# EAGLE design TalkingClock (EAGLE 8.7.0)
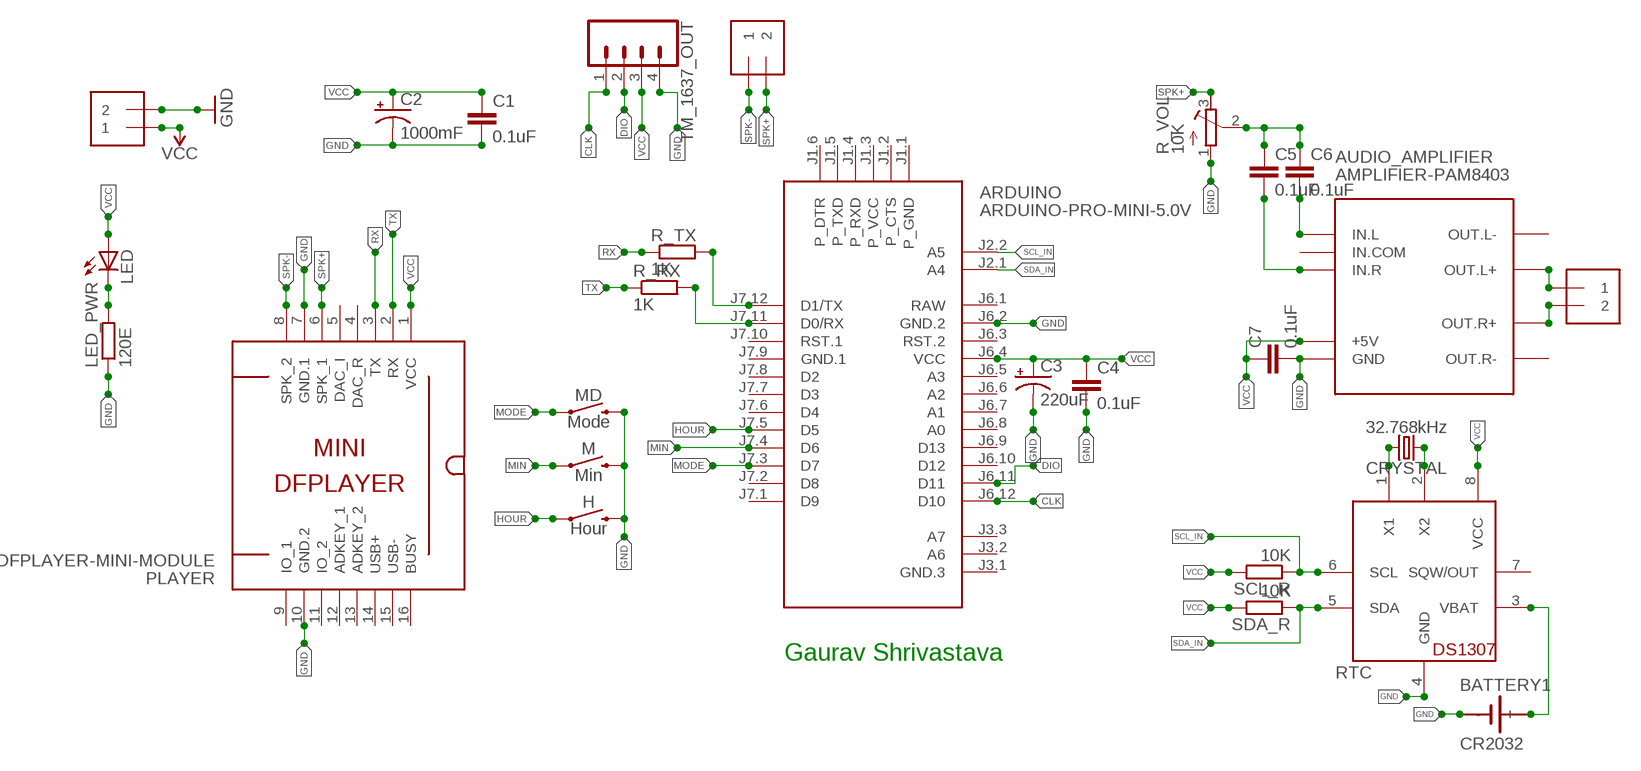
[diagram p0: schematic, sheet 1]

## Parts
ARDUINO  ARDUINO-PRO-MINI-5.0V  [ARDUINO-PRO-MINI]
AUDIO_AMPLIFIER  AMPLIFIER-PAM8403  [AMPLIFIER-PAM8403]
BATTERY1  CR2032  SN2032  [SN2032]
C1  0.1uF  0.1UF-KIT-EZ-50V-20%  [CAP-PTH-SMALL-KIT]
C2  1000mF  1000UF-RADIAL-5MM-25V-20%  [CPOL-RADIAL-5MM-10MM]
C3  220uF  100UF-POLAR-RADIAL-2.5MM-25V-20%  [CPOL-RADIAL-2.5MM-6.5MM]
C4  0.1uF  0.1UF-KIT-EZ-50V-20%  [CAP-PTH-SMALL-KIT]
C5  0.1uF  0.1UF-KIT-EZ-50V-20%  [CAP-PTH-SMALL-KIT]
C6  0.1uF  0.1UF-KIT-EZ-50V-20%  [CAP-PTH-SMALL-KIT]
C7  0.1uF  0.1UF-KIT-EZ-50V-20%  [CAP-PTH-SMALL-KIT]
CRYSTAL  32.768kHz  CRYSTAL-32.768KHZPTH-2X6  [CRYSTAL-PTH-2X6-CYL]
H  Hour  MOMENTARY-SWITCH-SPST-PTH-6.0MM  [TACTILE_SWITCH_PTH_6.0MM]
LED  LED5MM  [LED5MM]
LED_PWR  120E  R-EU_0204/7  [0204/7]
M  Min  MOMENTARY-SWITCH-SPST-PTH-6.0MM  [TACTILE_SWITCH_PTH_6.0MM]
MD  Mode  MOMENTARY-SWITCH-SPST-PTH-6.0MM  [TACTILE_SWITCH_PTH_6.0MM]
PLAYER  DFPLAYER-MINI-MODULE  [DFPLAYER-MINI-MODULE]
POWER-5-V  SPEAKER  1X2-3.5MM  [1X2-3.5MM]
PRE_SPK_OUT  SPEAKER  1X2-3.5MM  [1X2-3.5MM]
R_RX  1K  R-EU_0204/7  [0204/7]
R_TX  1K  R-EU_0204/7  [0204/7]
R_VOL  10K  R-TRIMM4G/J  [RTRIM4G/J]
RTC  DS1307  [DIL08]
SCL_R  10K  R-EU_0204/7  [0204/7]
SDA_R  10K  R-EU_0204/7  [0204/7]
SPEAKER  SPEAKER  1X2-3.5MM  [1X2-3.5MM]
TM_1637_OUT  CONN_04  [1X04]

## Nets
CLK: ARDUINO.J6.12(D10) TM_1637_OUT.1
DIO: ARDUINO.J6.11(D11) TM_1637_OUT.2
GND: ARDUINO.J6.2(GND.2) AUDIO_AMPLIFIER.GND BATTERY1.- C1.2 C2.- C3.2(-) C4.2 C7.2 H.3 LED_PWR.1 M.3 MD.3 PLAYER.7(GND.1) PLAYER.10(GND.2) POWER-5-V.2 R_VOL.1(A) RTC.4(GND) TM_1637_OUT.4
HOUR: ARDUINO.J7.5(D5) H.1
MIN: ARDUINO.J7.4(D6) M.1
MODE: ARDUINO.J7.3(D7) MD.1
N$1: ARDUINO.J7.12(D1/TX) R_TX.2
N$2: ARDUINO.J7.11(D0/RX) R_RX.2
N$3: LED.K(C) LED_PWR.2
N$4: CRYSTAL.2 RTC.1(X1)
N$5: CRYSTAL.1 RTC.2(X2)
N$6: AUDIO_AMPLIFIER.IN.L C6.2
N$7: AUDIO_AMPLIFIER.IN.R C5.2
N$8: AUDIO_AMPLIFIER.OUT.L+ SPEAKER.1
N$9: AUDIO_AMPLIFIER.OUT.R+ SPEAKER.2
N$13: BATTERY1.+ RTC.3(VBAT)
RX: PLAYER.3(TX) R_TX.1
SCL_IN: ARDUINO.J2.2(A5) RTC.6(SCL) SCL_R.1
SDA_IN: ARDUINO.J2.1(A4) RTC.5(SDA) SDA_R.1
SPK+: C5.1 C6.1 PLAYER.6(SPK_1) PRE_SPK_OUT.2 R_VOL.2(S) R_VOL.3(E)
SPK-: PLAYER.8(SPK_2) PRE_SPK_OUT.1
TX: PLAYER.2(RX) R_RX.1
VCC: ARDUINO.J6.4(VCC) AUDIO_AMPLIFIER.+5V C1.1 C2.+ C3.1(+) C4.1 C7.1 LED.A PLAYER.1(VCC) POWER-5-V.1 RTC.8(VCC) SCL_R.2 SDA_R.2 TM_1637_OUT.3
Unconnected: ARDUINO.J1.1(P_GND) ARDUINO.J1.2(P_CTS) ARDUINO.J1.3(P_VCC) ARDUINO.J1.4(P_RXD) ARDUINO.J1.5(P_TXD) ARDUINO.J1.6(P_DTR) ARDUINO.J3.1(GND.3) ARDUINO.J3.2(A6) ARDUINO.J3.3(A7) ARDUINO.J6.3(RST.2) ARDUINO.J6.5(A3) ARDUINO.J6.6(A2) ARDUINO.J6.7(A1) ARDUINO.J6.8(A0) ARDUINO.J6.9(D13) ARDUINO.J6.10(D12) ARDUINO.J7.1(D9) ARDUINO.J7.2(D8) ARDUINO.J7.6(D4) ARDUINO.J7.7(D3) ARDUINO.J7.8(D2) ARDUINO.J7.10(RST.1) AUDIO_AMPLIFIER.IN.COM AUDIO_AMPLIFIER.OUT.L- AUDIO_AMPLIFIER.OUT.R- PLAYER.4(DAC_R) PLAYER.5(DAC_I) PLAYER.9(IO_1) PLAYER.11(IO_2) PLAYER.12(ADKEY_1) PLAYER.13(ADKEY_2) PLAYER.14(USB+) PLAYER.15(USB-) PLAYER.16(BUSY) RTC.7(SQW/OUT)

## Notes on the sheet
- Gaurav Shrivastava

## Power pins joined to a net without a drawn wire
GND.1: ARDUINO.J7.9(GND.1)
RAW: ARDUINO.J6.1(RAW)

## Library data of the parts
ARDUINO = diy-modules:ARDUINO-PRO-MINI-*: Arduino Pro Mini and compatible devices More details available here: https://www.arduino.cc/en/Main/ArduinoBoardProMini Click here to find device on ebay.com <http://www.ebay.com/sch/arduino+pro+mini>
AUDIO_AMPLIFIER = diy-modules:AMPLIFIER-PAM8403: Stereo Class-D 3W Audio Amplifier based on PAM8403 chip More details available here: http://artofcircuits.com/product/pam8403-5v-two-channel-stereo-mini-class-d-3w3w-audio-amplifier Click here to find device on ebay.com <http://www.ebay.com/sch/pam8403+mini+class+d>
BATTERY1 = sn2032:SN2032: LI BATTERY
C1 C4-C7 = SparkFun-Capacitors:0.1UF: 0.1µF ceramic capacitors A capacitor is a passive two-terminal electrical component used to store electrical energy temporarily in an electric field.; PROD_ID: CAP-08370
C2 = SparkFun-Capacitors:1000UF: 1,000µF/1mF ceramic capacitors A capacitor is a passive two-terminal electrical component used to store electrical energy temporarily in an electric field. CAP-08070; PROD_ID: CAP-09538; VALUE: 1mF
C3 = SparkFun-Capacitors:100UF-POLAR: 100µF polarized capacitors A capacitor is a passive two-terminal electrical component used to store electrical energy temporarily in an electric field.; PROD_ID: CAP-08439; VALUE: 100uF
CRYSTAL = SparkFun-Clocks:CRYSTAL-32.768KHZ: 32.768kHz Crystal Frequency: 32.768kHz Frequency Stability: ±20ppm Load Capacitance: 12.5pF (PTH-2X6 & SMD-3.2X1.5), 6pF (SMD-2X6) SparkFun Products: SparkFun BigTime Watch Kit <https://www.sparkfun.com/products/11734> SparkFun nRF52832 Breakout <https://www.sparkfun.com/products/13990> SparkFun Real Time Clock Module <https://www.sparkfun.com/products/12708>; PROD_ID: XTAL-10112
H M MD = SparkFun-Switches:MOMENTARY-SWITCH-SPST: Momentary Switch (Pushbutton) - SPST Normally-open (NO) SPST momentary switches (buttons, pushbuttons). Variants PTH-12MM - 12mm square, through-hole Momentary Pushbutton Switch - 12mm Square <https://www.sparkfun.com/products/9190> (COM-09190) PTH-6.0MM, PTH-6.0MM-KIT - 6.0mm square, through-hole Mini Pushbutton Switch <https://www.sparkfun.com/products/97> (COM-00097) KIT package intended for soldering kit's - only one side of pads' copper is exposed. PTH-RIGHT-ANGLE-KIT - Right-angle, through-hole Right Angle Tactile Button <https://www.sparkfun.com/products/10791> - Used on SparkFun BigTime Watch Kit <https://www.sparkfun.com/products/11734> SMD-12MM - 12mm square, surface-mount Tactile Button - SMD (12mm) <https://www.sparkfun.com/products/12993> (COM-12993) Used on SparkFun PicoBoard <https://www.sparkfun.com/products/11888> SMD-4.5MM - 4.5mm Square Trackball Switch Used on SparkFun Blackberry Trackballer Breakout <https://www.sparkfun.com/products/13169> SMD-4.6MMX2.8MM - 4.60mm x 2.80mm, surface mount Used on SparkFun SAMD21 Mini Breakout <https://www.sparkfun.com/products/13664> SMD-5.2MM, SMD-5.2-REDUNDANT - 5.2mm square, surface-mount Mini Pushbutton Switch - SMD <https://www.sparkfun.com/products/8720> (COM-08720) Used on Arduino Pro Mini <https://www.sparkfun.com/products/11114> REDUNDANT package connects both switch circuits together SMD-6.0X3.5MM - 6.0 x 3.5mm, surface mount Momentary Reset Switch SMD <https://www.sparkfun.com/products/8229> (COM-08229) SMD-6.2MM-TALL - 6.2mm square, surface mount Tactile Button - SMD (6mm) <https://www.sparkfun.com/products/12992> Used on SparkFun Digital Sandbox <https://www.sparkfun.com/products/12651> SMD-RIGHT-ANGLE - Right-angle, surface mount Used on SparkFun Block for Intel® Edison - Arduino <https://www.sparkfun.com/products/13036>; PROD_ID: SWCH-08441; SF_SKU: COM-00097
LED = led:LED: LED OSRAM: - CHIPLED LG R971, LG N971, LY N971, LG Q971, LY Q971, LO R971, LY R971 LH N974, LH R974 LS Q976, LO Q976, LY Q976 LO Q996 - Hyper CHIPLED LW Q18S LB Q993, LB Q99A, LB R99A - SideLED LS A670, LO A670, LY A670, LG A670, LP A670 LB A673, LV A673, LT A673, LW A673 LH A674 LY A675 LS A676, LA A676, LO A676, LY A676, LW A676 LS A679, LY A679, LG A679 - Hyper Micro SIDELED® LS Y876, LA Y876, LO Y876, LY Y876 LT Y87S - SmartLED LW L88C, LW L88S LB L89C, LB L89S, LG L890 LS L89K, LO L89K, LY L89K LS L896, LA L896, LO L896, LY L896 - TOPLED LS T670, LO T670, LY T670, LG T670, LP T670 LSG T670, LSP T670, LSY T670, LOP T670, LYG T670 LG T671, LOG T671, LSG T671 LB T673, LV T673, LT T673, LW T673 LH T674 LS T676, LA T676, LO T676, LY T676, LB T676, LH T676, LSB T676, LW T676 LB T67C, LV T67C, LT T67C, LS T67K, LO T67K, LY T67K, LW E67C LS E67B, LA E67B, LO E67B, LY E67B, LB E67C, LV E67C, LT E67C LW T67C LS T679, LY T679, LG T679 LS T770, LO T770, LY T770, LG T770, LP T770 LB T773, LV T773, LT T773, LW T773 LH T774 LS E675, LA E675, LY E675, LS T675 LS T776, LA T776, LO T776, LY T776, LB T776 LHGB T686 LT T68C, LB T68C - Hyper Mini TOPLED® LB M676 - Mini TOPLED Santana® LG M470 LS M47K, LO M47K, LY M47K Source: http://www.osram.convergy.de LUXEON: - LUMILED® LXK2-PW12-R00, LXK2-PW12-S00, LXK2-PW14-U00, LXK2-PW14-V00 LXK2-PM12-R00, LXK2-PM12-S00, LXK2-PM14-U00 LXK2-PE12-Q00, LXK2-PE12-R00, LXK2-PE12-S00, LXK2-PE14-T00, LXK2-PE14-U00 LXK2-PB12-K00, LXK2-PB12-L00, LXK2-PB12-M00, LXK2-PB14-N00, LXK2-PB14-P00, LXK2-PB14-Q00 LXK2-PR12-L00, LXK2-PR12-M00, LXK2-PR14-Q00, LXK2-PR14-R00 LXK2-PD12-Q00, LXK2-PD12-R00, LXK2-PD12-S00 LXK2-PH12-R00, LXK2-PH12-S00 LXK2-PL12-P00, LXK2-PL12-Q00, LXK2-PL12-R00 Source: www.luxeon.com KINGBRIGHT: KA-3528ASYC Source: www.kingbright.com
LED_PWR R_RX R_TX SCL_R SDA_R = rcl:R-EU_: RESISTOR, European symbol; SPICEPREFIX: R
PLAYER = diy-modules:DFPLAYER-MINI-MODULE: DFPlayer Mini - MP3 player module based on YX5200 chip More details available here: https://www.dfrobot.com/wiki/index.php/DFPlayer_Mini_SKU:DFR0299 Click here to find device on ebay.com <http://www.ebay.com/sch/dfplayer+mini>
POWER-5-V PRE_SPK_OUT SPEAKER = adafruit:1X2: 3.5mm Terminal block http://www.ladyada.net/library/pcb/eaglelibrary.html
R_VOL = resistor:R-TRIMM: Trimm resistor
RTC = adafruit:DS1307: DS1307 Real time clock (RTC) with battery backup ability. Talk to it via i2c
TM_1637_OUT = SparkFun-Connectors:CONN_04: Multi connection point. Often used as Generic Header-pin footprint for 0.1 inch spaced/style header connections On any of the 0.1 inch spaced packages, you can populate with these: Break Away Headers - Straight <https://www.sparkfun.com/products/116> (PRT-00116) Break Away Male Headers - Right Angle <https://www.sparkfun.com/products/553> (PRT-00553) Female Headers <https://www.sparkfun.com/products/115> (PRT-00115) Break Away Headers - Machine Pin <https://www.sparkfun.com/products/117> (PRT-00117) Break Away Female Headers - Swiss Machine Pin <https://www.sparkfun.com/products/743> (PRT-00743) For SCREWTERMINALS and SPRING TERMINALS visit here: Screw Terimnals on SparkFun.com <https://www.sparkfun.com/search/results?term=Screw+Terminals> (5mm/3.5mm/2.54mm spacing) This device is also useful as a general connection point to wire up your design to another part of your project. Our various solder wires solder well into these plated through hole pads. Hook-Up Wire - Assortment (Stranded, 22 AWG) <https://www.sparkfun.com/products/11375> (PRT-11375) Hook-Up Wire - Assortment (Solid Core, 22 AWG) <https://www.sparkfun.com/products/11367> (PRT-11367) View the entire wire category on our website here <https://www.sparkfun.com/categories/141> Special notes: Molex polarized connector foot print use with SKU : PRT-08231 with associated crimp pins and housings. 1MM SMD Version SKU: PRT-10208; PROD_ID: CONN-09696

## Board
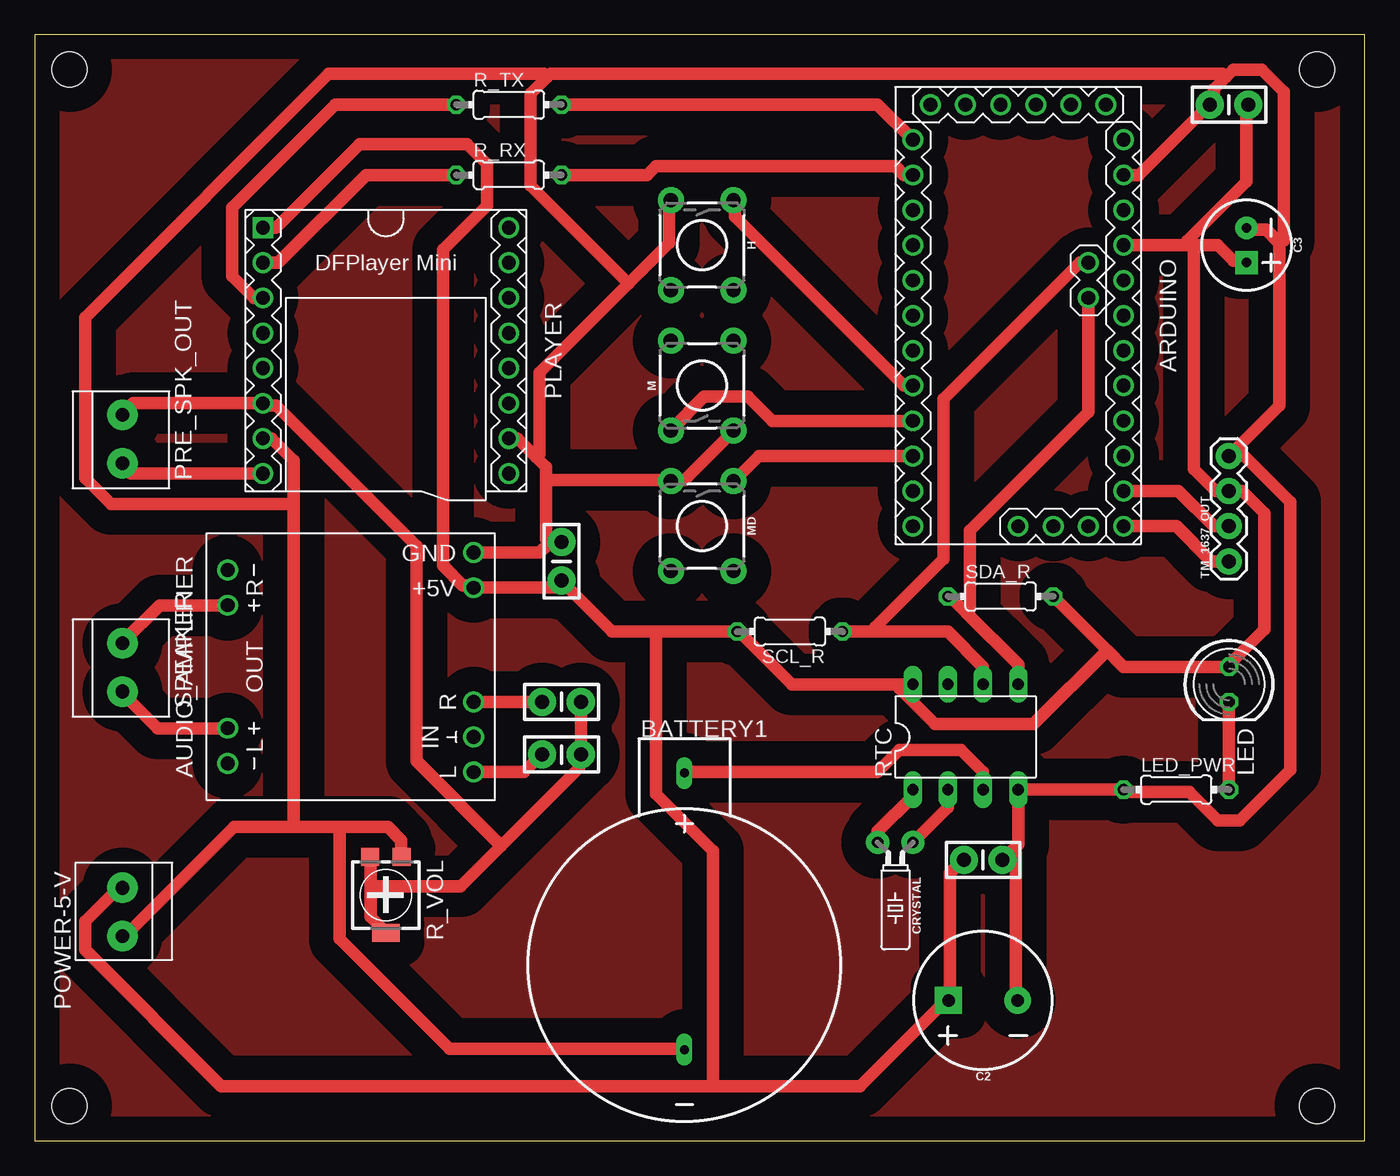
[diagram p1: board, top side]

Size 96.19 x 80 mm. Coordinates in mm from the lower left corner, seen from the top.
Outline: 0,0 96.19,0 96.19,80 0,80 0,0
Copper layers (1*16): Top 0.035mm / dielectric 1.5mm / Bottom 0.035mm
Design rules "default *": minimum track width 35mil, minimum drill 1mm, track to track 40mil, track to pad 40mil, pad to pad 6mil, via to via 6mil, smd to smd 6mil, copper to edge 40mil, drill to drill 10mil, minimum pad ring 10mil, minimum via ring 8mil, stop-mask expansion 4mil, vias tented up to drill 0mil, thermal gap 10mil
Holes 2.54 mm at 2.54,77.47 2.54,2.54 92.71,2.54 92.71,77.47

### Footprints (pad centres in the part's own frame; a part is rotated, then mirrored left to right if it is on the bottom)
ARDUINO-PRO-MINI = drill 1: J1.1 -15.24,6.35; J1.2 -15.24,3.81; J1.3 -15.24,1.27; J1.4 -15.24,-1.27; J1.5 -15.24,-3.81; J1.6 -15.24,-6.35; J2.1 -1.27,5.08; J2.2 -3.81,5.08; J3.1 15.24,0; J3.2 15.24,2.54; J3.3 15.24,5.08; J6.1 -12.7,7.62; J6.2 -10.16,7.62; J6.3 -7.62,7.62; J6.4 -5.08,7.62; J6.5 -2.54,7.62; J6.6 0,7.62; J6.7 2.54,7.62; J6.8 5.08,7.62; J6.9 7.62,7.62; J6.10 10.16,7.62; J6.11 12.7,7.62; J6.12 15.24,7.62; J7.1 15.24,-7.62; J7.2 12.7,-7.62; J7.3 10.16,-7.62; J7.4 7.62,-7.62; J7.5 5.08,-7.62; J7.6 2.54,-7.62; J7.7 0,-7.62; J7.8 -2.54,-7.62; J7.9 -5.08,-7.62; J7.10 -7.62,-7.62; J7.11 -10.16,-7.62; J7.12 -12.7,-7.62
AMPLIFIER-PAM8403 = drill 1: +5V 5.715,-8.89; GND 8.255,-8.89; IN.COM -5.08,-8.89; IN.L -7.62,-8.89; IN.R -2.54,-8.89; OUT.L+ -4.445,8.89; OUT.L- -6.985,8.89; OUT.R+ 4.445,8.89; OUT.R- 6.985,8.89
SN2032 = drill 0.65 long: + 0,13.9; - 0,-6.1
CAP-PTH-SMALL-KIT = drill 1.016 pad 2.032: 1 -1.397,0; 2 1.397,0
CPOL-RADIAL-5MM-10MM = drill 0.9 pad 1.93 square: + 2.5,0 | drill 0.9 pad 1.93: - -2.5,0
CPOL-RADIAL-2.5MM-6.5MM = drill 0.7 pad 1.651 square: 1 1.25,0 | drill 0.7 pad 1.651: 2 -1.25,0
CRYSTAL-PTH-2X6-CYL = drill 0.813 pad 1.676: 1 -1.27,0; 2 1.27,0
TACTILE_SWITCH_PTH_6.0MM = drill 1.016 pad 1.88: 1 -3.251,2.261; 2 3.251,2.261; 3 -3.251,-2.261; 4 3.251,-2.261
LED5MM = drill 0.813 octagon: A -1.27,0; K 1.27,0
0204/7 = drill 0.813 octagon: 1 -3.81,0; 2 3.81,0
DFPLAYER-MINI-MODULE = drill 1 square: 1 -8.89,-8.89 | drill 1: 2 -6.35,-8.89; 3 -3.81,-8.89; 4 -1.27,-8.89; 5 1.27,-8.89; 6 3.81,-8.89; 7 6.35,-8.89; 8 8.89,-8.89; 9 8.89,8.89; 10 6.35,8.89; 11 3.81,8.89; 12 1.27,8.89; 13 -1.27,8.89; 14 -3.81,8.89; 15 -6.35,8.89; 16 -8.89,8.89
1X2-3.5MM = drill 1 pad 2.184: 1 1.8,0; 2 -1.7,0
RTRIM4G/J = smd 1.3 x 1.3: 1 -1.15,-2.75; 3 1.15,-2.75 | smd 2 x 1.3: 2 0,2.75
DIL08 = drill 0.813 long: 1 -3.81,-3.81; 2 -1.27,-3.81; 3 1.27,-3.81; 4 3.81,-3.81; 5 3.81,3.81; 6 1.27,3.81; 7 -1.27,3.81; 8 -3.81,3.81
1X04 = drill 1.016 pad 1.88: 1 0,0; 2 2.54,0; 3 5.08,0; 4 7.62,0

### Placement (x,y rotation side)
ARDUINO  71.12,59.69 270 top
AUDIO_AMPLIFIER  22.86,34.29 90 top
BATTERY1  46.99,12.7 0 top
C1  38.1,41.91 90 top
C2  68.58,10.16 180 top
C3  87.63,64.77 270 top
C4  68.58,20.32 0 top
C5  38.1,31.75 180 top
C6  38.1,27.94 180 top
C7  86.36,74.93 180 top
CRYSTAL  62.23,21.59 180 top
H  48.26,64.77 270 top
LED  86.36,33.02 270 top
LED_PWR  82.55,25.4 0 top
M  48.26,54.61 90 top
MD  48.26,44.45 270 top
PLAYER  25.4,57.15 270 top
POWER-5-V  6.35,16.51 90 top
PRE_SPK_OUT  6.35,50.8 270 top
R_RX  34.29,69.85 0 top
R_TX  34.29,74.93 0 top
R_VOL  25.4,17.78 180 top
RTC  67.31,29.21 0 top
SCL_R  54.61,36.83 180 top
SDA_R  69.85,39.37 0 top
SPEAKER  6.35,34.29 270 top
TM_1637_OUT  86.36,41.91 90 top

### Tracks (layer width: path | path; a pad name or v marks a point on that pad's centre or on a via)
CLK
  Top 0.889: ARDUINO.J6.12 82.55,44.45 85.09,41.91 TM_1637_OUT.1
DIO
  Top 0.889: ARDUINO.J6.11 82.71,46.99 85.25,44.45 TM_1637_OUT.2
GND
  Top 0.889: 18.73,22.7 14.45,22.7 6.67,14.92 6.35,14.92 POWER-5-V.2 | 18.73,22.7 22.07,22.7 | 22.07,22.7 25.56,22.7 26.51,21.75 26.51,20.64 R_VOL.1 | 22.07,22.7 22.07,14.61 30,6.67 46.99,6.67 BATTERY1.- | PLAYER.7 17.14,50.8 18.73,49.21 18.73,46.04 | 18.73,22.7 18.73,46.04 | M.3 50.48,51.28 46.99,47.78 46.04,47.78 MD.3 45.56,47.78 36.99,47.78 | AUDIO_AMPLIFIER.GND 36.51,42.55 37.15,43.18 | 37.15,43.18 38.1,43.18 C1.2 | PLAYER.10 34.92,50.8 36.27,49.45 | 36.27,49.45 36.99,48.74 36.99,47.78 | 36.99,47.78 36.99,43.5 37.15,43.18 | 42.94,61.99 36.51,55.56 36.51,49.69 36.27,49.45 | 42.94,61.99 45.88,64.93 45.88,67.94 H.3 | 70.72,21.03 70.01,20.32 C4.2 | 70.72,21.03 71.12,21.43 RTC.4 LED_PWR.1 79.06,25.24 83.5,25.24 85.57,23.18 87.15,23.18 90.81,26.83 90.81,46.2 87.15,49.85 TM_1637_OUT.4 90.01,53.18 90.01,64.93 | C2.- 70.96,10.16 70.96,20.8 70.72,21.03 | ARDUINO.J6.2 79.85,69.85 84.93,74.93 C7.2 85.25,75.25 85.25,76.04 86.12,76.91 | 90.01,64.93 89.06,65.88 87.63,65.88 C3.2 | 86.12,76.91 86.68,77.47 88.74,77.47 90.33,75.88 90.33,65.09 90.01,64.93 | 42.94,61.99 35.88,69.06 35.88,75.72 37.07,76.91 | 37.07,76.91 37.31,77.15 85.88,77.15 86.12,76.91 | 18.73,46.04 5.56,46.04 3.65,47.94 3.65,59.53 21.27,77.15 36.83,77.15 37.07,76.91
HOUR
  Top 0.889: ARDUINO.J7.5 62.87,54.61 50.64,66.83 50.64,67.94 H.1
MIN
  Top 0.889: ARDUINO.J7.4 53.34,52.07 51.59,53.82 48.42,53.82 46.04,51.44 M.1
MODE
  Top 0.889: ARDUINO.J7.3 52.39,49.53 50.64,47.78 MD.1
N$1
  Top 0.889: R_TX.2 60.96,74.93 ARDUINO.J7.12
N$2
  Top 0.889: R_RX.2 44.29,69.85 44.93,70.48 62.23,70.48 62.87,69.85 ARDUINO.J7.11
N$3
  Top 0.889: LED.K LED_PWR.2
N$4
  Top 0.889: RTC.1 63.5,24.92 60.96,22.38 CRYSTAL.2
N$5
  Top 0.889: RTC.2 66.04,24.13 CRYSTAL.1
N$6
  Top 0.889: AUDIO_AMPLIFIER.IN.L 35.4,26.67 36.67,27.94 C6.2
N$7
  Top 0.889: C5.2 AUDIO_AMPLIFIER.IN.R
N$8
  Top 0.889: AUDIO_AMPLIFIER.OUT.L+ 8.89,29.84 6.35,32.38 SPEAKER.1
N$9
  Top 0.889: AUDIO_AMPLIFIER.OUT.R+ 9.05,38.73 6.35,36.04 SPEAKER.2
N$10
  pour Top (isolate 1.778): 0,80.01 95.25,80.01 95.25,0 0,0
N$13
  Top 0.889: RTC.3 68.58,26.67 66.99,28.26 62.55,28.26 60.96,26.67 46.99,26.67 BATTERY1.+
RX
  Top 0.889: R_TX.1 21.75,74.93 14.29,67.47 14.29,62.55 15.88,60.96 PLAYER.3
SCL_IN
  Top 0.889: 60.8,36.83 66.04,36.83 68.58,34.29 RTC.6 | 60.8,36.83 SCL_R.1 | ARDUINO.J2.2 75.56,63.5 65.72,53.66 65.72,42.07 60.8,37.15 60.8,36.83
SDA_IN
  Top 0.889: RTC.5 71.12,34.45 67.39,38.18 | 67.39,38.18 66.2,39.37 SDA_R.1 | ARDUINO.J2.1 76.2,52.7 67.63,44.13 67.63,38.42 67.39,38.18
SPK+
  Top 0.889: PRE_SPK_OUT.2 6.35,52.55 7.14,53.34 PLAYER.6 16.83,53.18 17.46,53.18 27.62,43.02 27.62,27.46 33.73,21.35 | 24.29,18.41 24.29,16.19 25.4,15.08 R_VOL.2 | 24.29,18.41 24.29,20.48 R_VOL.3 | 24.29,18.41 30.8,18.41 33.73,21.35 | 33.73,21.35 39.37,26.99 39.37,27.94 C6.1 39.53,28.26 39.53,31.75 C5.1
SPK-
  Top 0.889: PLAYER.8 6.99,48.26 6.35,48.9 PRE_SPK_OUT.1
TX
  Top 0.889: R_RX.1 23.97,69.85 17.62,63.5 PLAYER.2
VCC
  Top 0.889: C4.1 67.15,20.32 66.2,19.37 66.2,10.16 C2.+ 65.72,10 59.69,3.97 49.05,3.97 | 49.05,3.97 13.49,3.97 3.65,13.81 3.65,15.88 6.03,18.26 6.35,18.26 POWER-5-V.1 | 83.82,64.77 85.57,64.77 86.68,63.66 87.63,63.66 C3.1 | 83.82,64.77 83.34,64.77 | 83.34,64.77 ARDUINO.J6.4 | C7.1 87.63,74.93 87.63,69.37 83.34,65.09 83.34,64.77 | SDA_R.2 77.55,35.48 | 77.55,35.48 78.74,34.29 LED.A 86.52,34.61 88.9,36.99 88.9,45.4 87.31,46.99 TM_1637_OUT.3 85.41,46.99 83.82,48.58 83.82,64.77 | 44.93,36.83 41.75,36.83 38.1,40.48 C1.1 38.1,40.01 AUDIO_AMPLIFIER.+5V 31.43,40.16 30.96,40.16 29.53,41.59 29.53,64.45 32.7,67.63 32.7,70.64 31.27,72.07 23.5,72.07 17.46,66.04 PLAYER.1 | 44.93,36.83 SCL_R.2 51.12,36.67 54.77,33.02 62.55,33.02 | 62.55,33.02 RTC.8 | 77.55,35.48 72.23,30.16 65.09,30.16 62.55,32.7 62.55,33.02 | 49.05,3.97 49.05,20.95 44.93,25.08 44.93,36.83

### Text on the board
tRestrict: Gaurav